# Altium project Netscale48HD_Sensorbar_Slave.PrjPcb
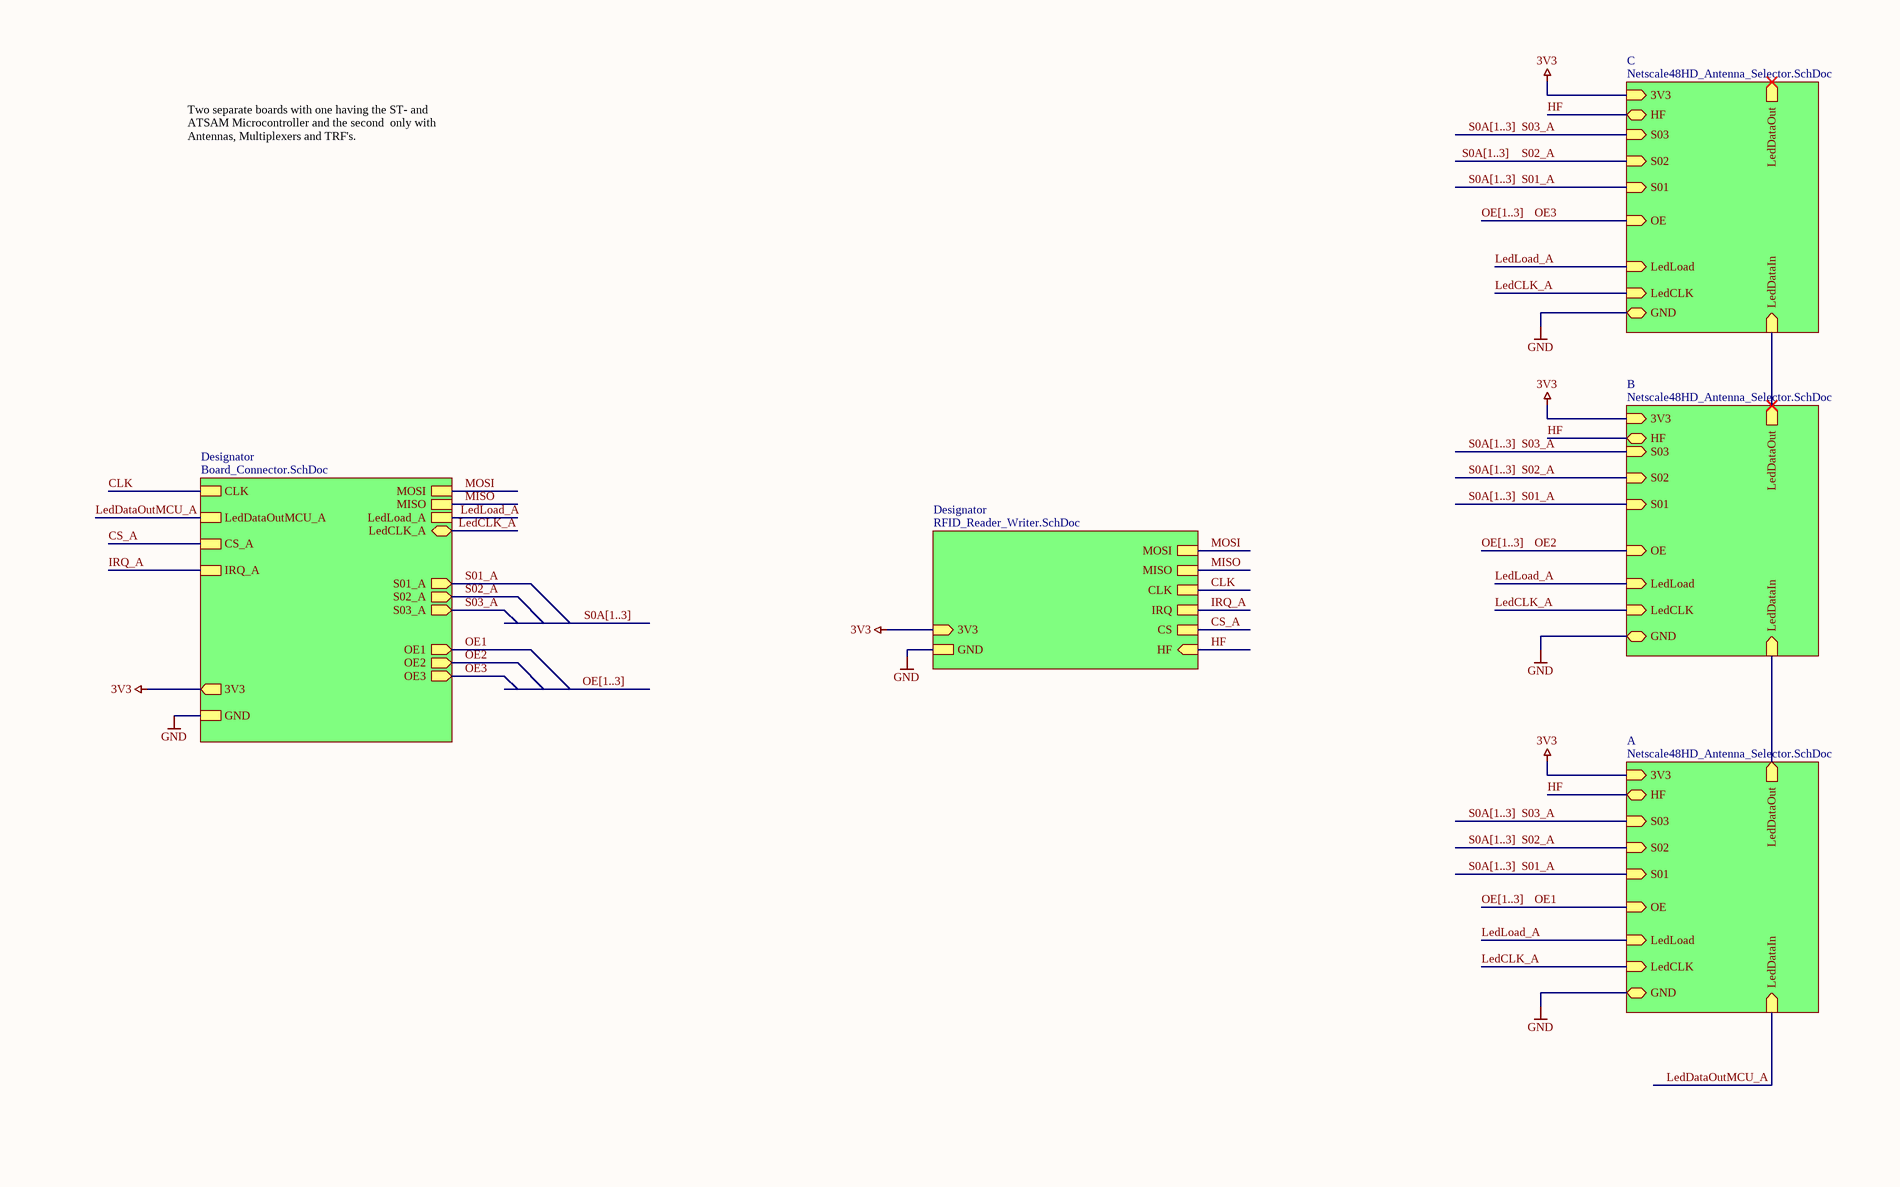
[diagram p0: Netscale48HD_Sensorbar.SchDoc, top]
4 sheets, 214 parts. Net scope: hierarchical (ports join the sheet entries above them; power ports are global).
Board file: Netscale48HD_Sensorbar_Slave.PcbDoc
Sheets:
  Netscale48HD_Sensorbar.SchDoc
    A = Netscale48HD_Antenna_Selector.SchDoc
    B = Netscale48HD_Antenna_Selector.SchDoc
    C = Netscale48HD_Antenna_Selector.SchDoc
    Designator = RFID_Reader_Writer.SchDoc
    Designator = Board_Connector.SchDoc

## Sheet Netscale48HD_Sensorbar.SchDoc: Sensorbar Slave Overall Schematic
size A3; CompanyName: Reichle & De-Massari; Organization: Reichle & De-Massari; Address1: Binzstrasse 32; Address2: 8620 Wetzikon; Address3: Switzerland; DocumentNumber: 1; Revision: V0.2; SheetNumber: 1; SheetTotal: 5

### Sub-sheets
A = Netscale48HD_Antenna_Selector.SchDoc: 3V3 (in), S03 (in), S02 (in), S01 (in), HF (bidir), LedLoad (in), LedCLK (in), GND (bidir), LedDataOut (out), LedDataIn (in), OE (in)
B = Netscale48HD_Antenna_Selector.SchDoc: 3V3 (in), S03 (in), S02 (in), S01 (in), HF (bidir), LedLoad (in), LedCLK (in), GND (bidir), LedDataOut (out), LedDataIn (in), OE (in)
C = Netscale48HD_Antenna_Selector.SchDoc: 3V3 (in), S03 (in), S02 (in), S01 (in), HF (bidir), LedLoad (in), LedCLK (in), GND (bidir), LedDataOut (out), LedDataIn (in), OE (in)
Designator = RFID_Reader_Writer.SchDoc: MOSI, MISO, 3V3 (in), GND, CLK, IRQ, HF (in), CS
Designator = Board_Connector.SchDoc: CLK, 3V3 (out), GND, MOSI, MISO, S01_A (out), S02_A (out), S03_A (out), LedLoad_A, LedCLK_A (bidir), OE1 (out), OE2 (out), OE3 (out), LedDataOutMCU_A, CS_A, IRQ_A

### Nets
3V3: sheet A/3V3, sheet B/3V3, sheet C/3V3, sheet Designator/3V3, sheet Designator/3V3
GND: sheet A/GND, sheet B/GND, sheet C/GND, sheet Designator/GND, sheet Designator/GND
CLK: sheet Designator/CLK, sheet Designator/CLK
CS_A: sheet Designator/CS, sheet Designator/CS_A  [project net CS]
HF: sheet A/HF, sheet B/HF, sheet C/HF, sheet Designator/HF
IRQ_A: sheet Designator/IRQ, sheet Designator/IRQ_A  [project net IRQ]
LedCLK_A: sheet A/LedCLK, sheet B/LedCLK, sheet C/LedCLK, sheet Designator/LedCLK_A  [project net LedCLK]
LedDataIn: sheet A/LedDataOut, sheet B/LedDataIn
LedDataIn: sheet B/LedDataOut, sheet C/LedDataIn  [a separate net that carries the same name]
LedDataOutMCU_A: sheet A/LedDataIn, sheet Designator/LedDataOutMCU_A  [project net LedDataIn]
LedLoad_A: sheet A/LedLoad, sheet B/LedLoad, sheet C/LedLoad, sheet Designator/LedLoad_A  [project net LedLoad]
MISO: sheet Designator/MISO, sheet Designator/MISO
MOSI: sheet Designator/MOSI, sheet Designator/MOSI
OE1: sheet A/OE, sheet Designator/OE1  [project net OE]
OE2: sheet B/OE, sheet Designator/OE2  [project net OE]
OE3: sheet C/OE, sheet Designator/OE3  [project net OE]
S01_A: sheet A/S01, sheet B/S01, sheet C/S01, sheet Designator/S01_A  [project net S01]
S02_A: sheet A/S02, sheet B/S02, sheet C/S02, sheet Designator/S02_A  [project net S02]
S03_A: sheet A/S03, sheet B/S03, sheet C/S03, sheet Designator/S03_A  [project net S03]

### Buses and harness runs
bus OE[1..3]
bus S0A[1..3]

### Notes on the sheet
- 10,8
- 16,8
- 7
- 212,4
- Two separate boards with one having the ST- and ATSAM Microcontroller and the second  only with Antennas, Multiplexers and TRF's.
- Title
- Size:
- Date:
- A3
- Number:
- Time:
- Revision:
- Sheet
- of
- File:

## Sheet Netscale48HD_Antenna_Selector.SchDoc: Antenna Selector & LED
size A3; Author: NK; CompanyName: Reichle & De-Massari; Organization: Reichle & De-Massari; Address1: Binzstrasse 32; Address2: 8620 Wetzikon; Address3: Switzerland; DocumentNumber: 2; Revision: V0.2; SheetNumber: 2; SheetTotal: 2; Organization1: Reichle & De-Massari; Size: A4; ShortDescription: Shift Register for Switches and Leds, multiplexer for Antennas
Used 3 times, as channels A, B, C. Parts and nets are listed once, with the designators drawn on the sheet.
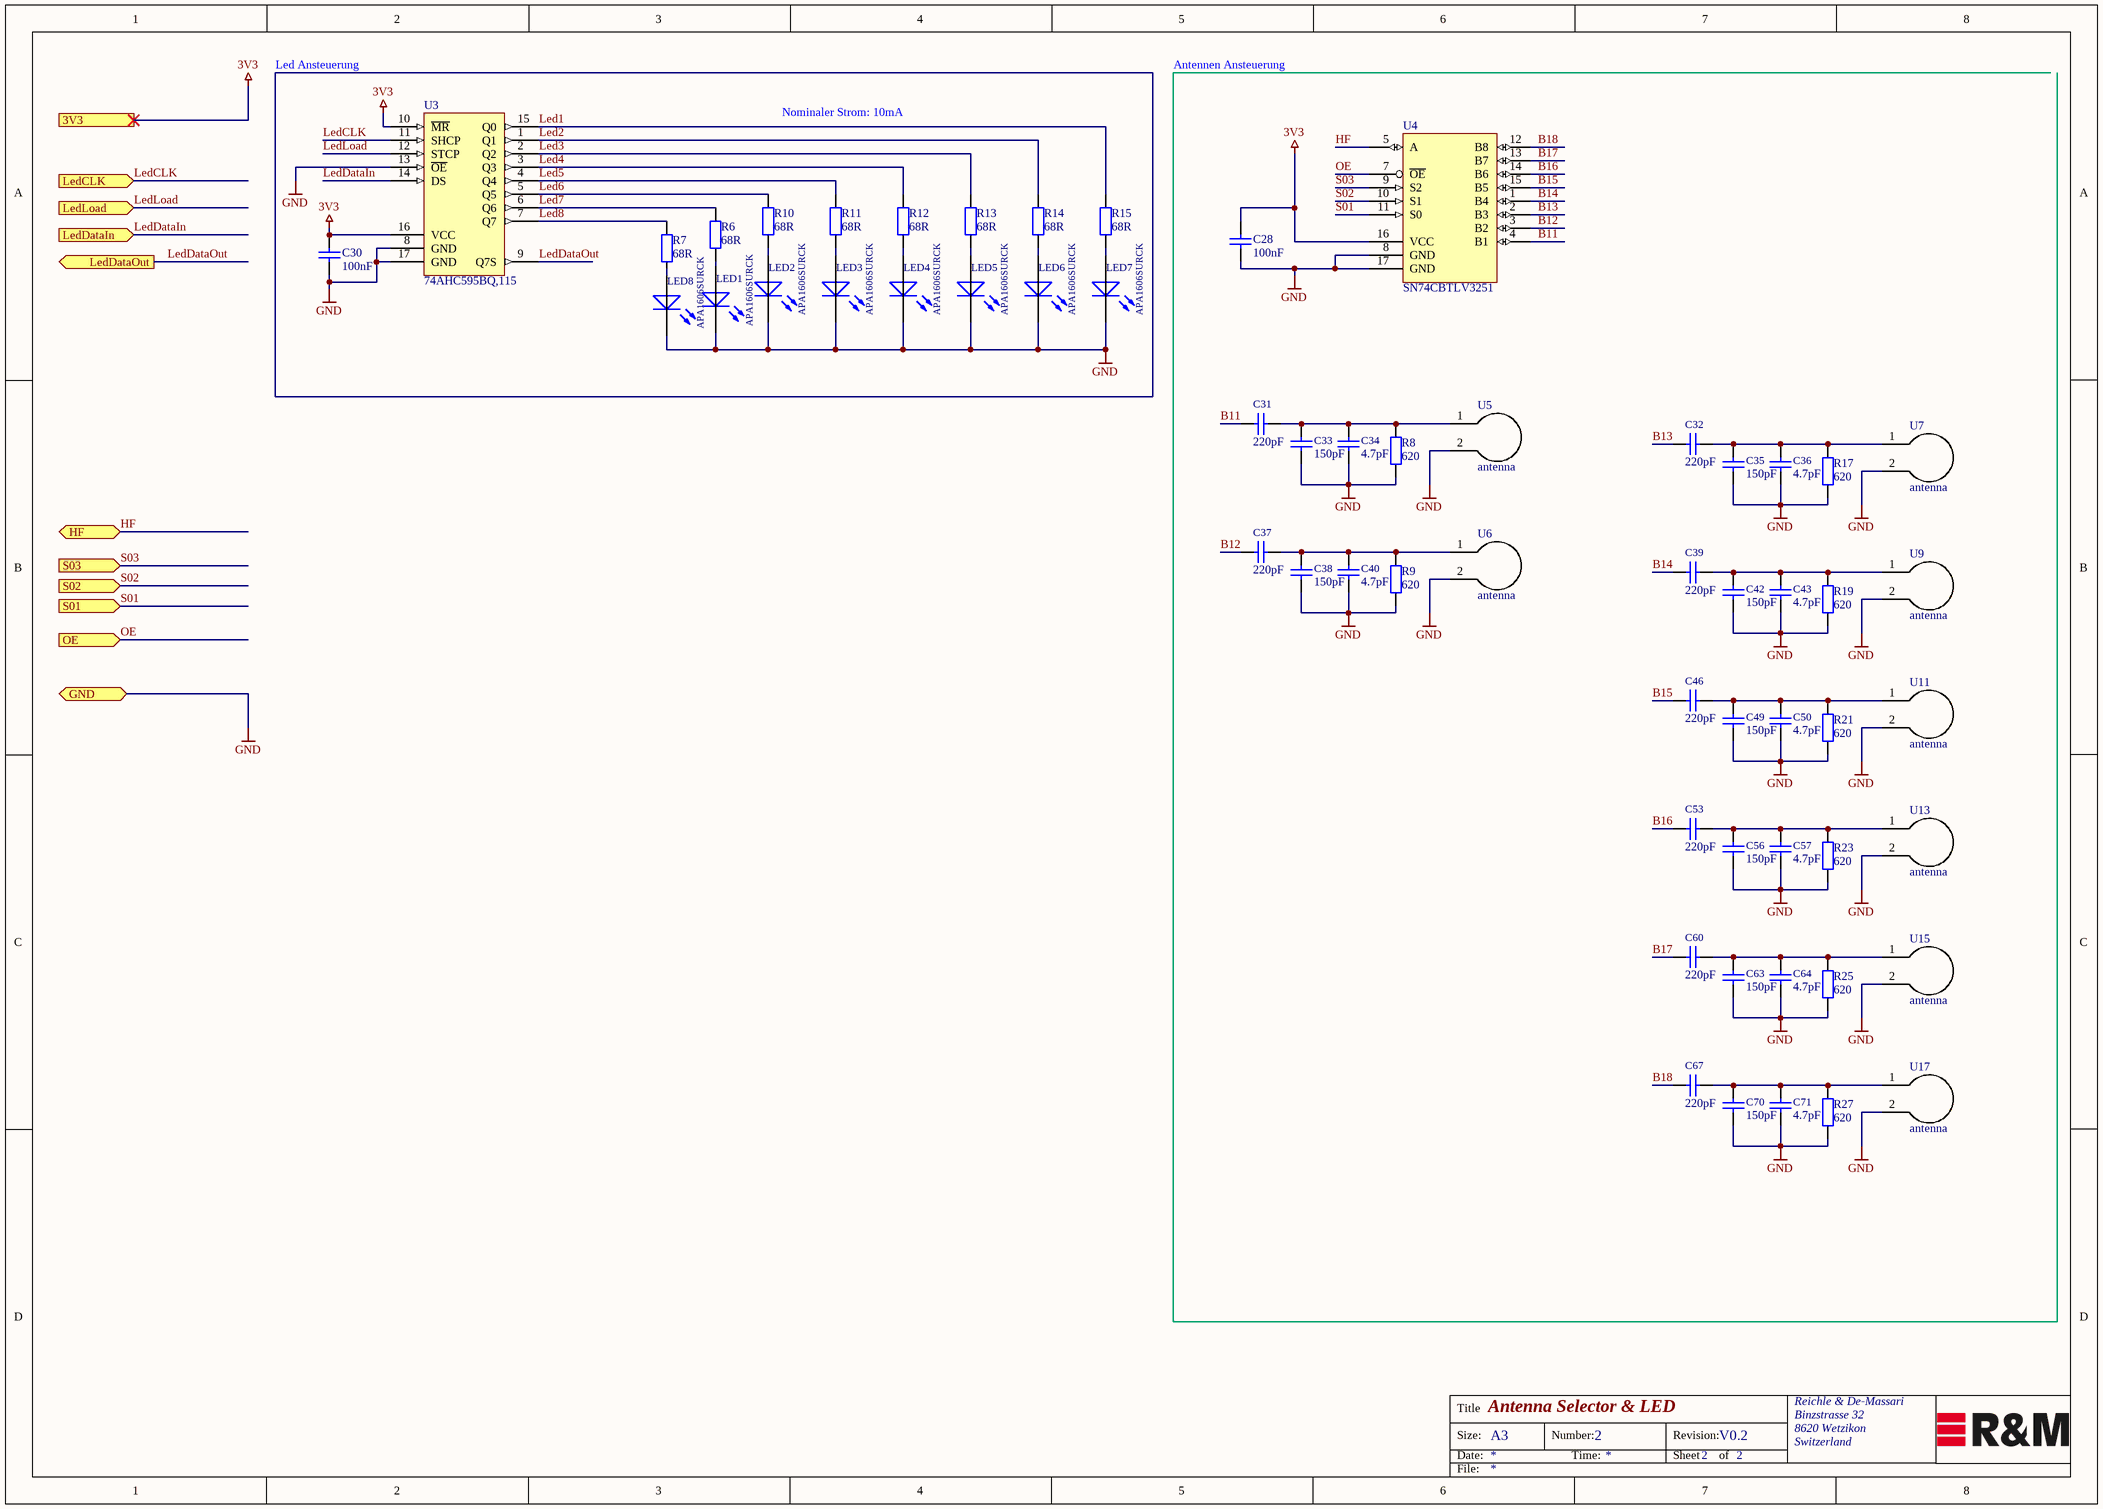
[diagram p1: Netscale48HD_Antenna_Selector.SchDoc]

### Parts
C28  value 100nF  [CAPC1005X55N]  (hidden comment: LMK105BJ104KV-F)
C30  value 100nF  [CAPC1005X55N]  (hidden comment: LMK105BJ104KV-F)
C31  value 220pF  [CAPC1005X55N]  (hidden comment: GCM1555C1H221FA16D)
C32  value 220pF  [CAPC1005X55N]  (hidden comment: GCM1555C1H221FA16D)
C33  value 150pF  [CAPC1005X55N]  (hidden comment: GRM1555C1H151FA01D)
C34  value 4.7pF  [CAPC1005X55N]  (hidden comment: GJM1555C1H4R7WB01D)
C35  value 150pF  [CAPC1005X55N]  (hidden comment: GRM1555C1H151FA01D)
C36  value 4.7pF  [CAPC1005X55N]  (hidden comment: GJM1555C1H4R7WB01D)
C37  value 220pF  [CAPC1005X55N]  (hidden comment: GCM1555C1H221FA16D)
C38  value 150pF  [CAPC1005X55N]  (hidden comment: GRM1555C1H151FA01D)
C39  value 220pF  [CAPC1005X55N]  (hidden comment: GCM1555C1H221FA16D)
C40  value 4.7pF  [CAPC1005X55N]  (hidden comment: GJM1555C1H4R7WB01D)
C42  value 150pF  [CAPC1005X55N]  (hidden comment: GRM1555C1H151FA01D)
C43  value 4.7pF  [CAPC1005X55N]  (hidden comment: GJM1555C1H4R7WB01D)
C46  value 220pF  [CAPC1005X55N]  (hidden comment: GCM1555C1H221FA16D)
C49  value 150pF  [CAPC1005X55N]  (hidden comment: GRM1555C1H151FA01D)
C50  value 4.7pF  [CAPC1005X55N]  (hidden comment: GJM1555C1H4R7WB01D)
C53  value 220pF  [CAPC1005X55N]  (hidden comment: GCM1555C1H221FA16D)
C56  value 150pF  [CAPC1005X55N]  (hidden comment: GRM1555C1H151FA01D)
C57  value 4.7pF  [CAPC1005X55N]  (hidden comment: GJM1555C1H4R7WB01D)
C60  value 220pF  [CAPC1005X55N]  (hidden comment: GCM1555C1H221FA16D)
C63  value 150pF  [CAPC1005X55N]  (hidden comment: GRM1555C1H151FA01D)
C64  value 4.7pF  [CAPC1005X55N]  (hidden comment: GJM1555C1H4R7WB01D)
C67  value 220pF  [CAPC1005X55N]  (hidden comment: GCM1555C1H221FA16D)
C70  value 150pF  [CAPC1005X55N]  (hidden comment: GRM1555C1H151FA01D)
C71  value 4.7pF  [CAPC1005X55N]  (hidden comment: GJM1555C1H4R7WB01D)
LED1  APA1606SURCK  [Kingbright_SMD_2_RWH]
LED2  APA1606SURCK  [Kingbright_SMD_2_RWH]
LED3  APA1606SURCK  [Kingbright_SMD_2_RWH]
LED4  APA1606SURCK  [Kingbright_SMD_2_RWH]
LED5  APA1606SURCK  [Kingbright_SMD_2_RWH]
LED6  APA1606SURCK  [Kingbright_SMD_2_RWH]
LED7  APA1606SURCK  [Kingbright_SMD_2_RWH]
LED8  APA1606SURCK  [Kingbright_SMD_2_RWH]
R6  value 68R  [RESC1005X40N]  (hidden comment: CRGP0402F68R)
R7  value 68R  [RESC1005X40N]  (hidden comment: CRGP0402F68R)
R8  value 620  [RESC1005X40N]  (hidden comment: ERJ-2RKF6200X)
R9  value 620  [RESC1005X40N]  (hidden comment: ERJ-2RKF6200X)
R10  value 68R  [RESC1005X40N]  (hidden comment: CRGP0402F68R)
R11  value 68R  [RESC1005X40N]  (hidden comment: CRGP0402F68R)
R12  value 68R  [RESC1005X40N]  (hidden comment: CRGP0402F68R)
R13  value 68R  [RESC1005X40N]  (hidden comment: CRGP0402F68R)
R14  value 68R  [RESC1005X40N]  (hidden comment: CRGP0402F68R)
R15  value 68R  [RESC1005X40N]  (hidden comment: CRGP0402F68R)
R17  value 620  [RESC1005X40N]  (hidden comment: ERJ-2RKF6200X)
R19  value 620  [RESC1005X40N]  (hidden comment: ERJ-2RKF6200X)
R21  value 620  [RESC1005X40N]  (hidden comment: ERJ-2RKF6200X)
R23  value 620  [RESC1005X40N]  (hidden comment: ERJ-2RKF6200X)
R25  value 620  [RESC1005X40N]  (hidden comment: ERJ-2RKF6200X)
R27  value 620  [RESC1005X40N]  (hidden comment: ERJ-2RKF6200X)
U3  74AHC595BQ,115  [NexperiaUSAInc_16-VFQFN_16_R]
U4  SN74CBTLV3251  [TexasInstruments_16-VFQFN_16_R]
U5  antenna  [antenna_1_layer]  (net tie)
U6  antenna  [antenna_1_layer]  (net tie)
U7  antenna  [antenna_1_layer]  (net tie)
U9  antenna  [antenna_1_layer]  (net tie)
U11  antenna  [antenna_1_layer]  (net tie)
U13  antenna  [antenna_1_layer]  (net tie)
U15  antenna  [antenna_1_layer]  (net tie)
U17  antenna  [antenna_1_layer]  (net tie)

### Ports
3V3, GND (bidir), HF (bidir), LedCLK (in), LedDataIn (in), LedDataOut (out), LedLoad (in), OE (in), S01 (in), S02 (in), S03 (in)

### Nets
3V3: C28.2 C30.2 U3.10(~{MR}) U3.16(VCC) U4.16(VCC) ; port 3V3
GND: C28.1 C30.1 C33.1(Pos) C34.1(Pos) C35.1(Pos) C36.1(Pos) C38.1(Pos) C40.1(Pos) C42.1(Pos) C43.1(Pos) C49.1(Pos) C50.1(Pos) C56.1(Pos) C57.1(Pos) C63.1(Pos) C64.1(Pos) C70.1(Pos) C71.1(Pos) LED1.1(K) LED2.1(K) LED3.1(K) LED4.1(K) LED5.1(K) LED6.1(K) LED7.1(K) LED8.1(K) R8.1 R9.1 R17.1 R19.1 R21.1 R23.1 R25.1 R27.1 U3.8(GND) U3.13(~{OE}) U3.17(GND) U4.8(GND) U4.17(GND) U5.2 U6.2 U7.2 U9.2 U11.2 U13.2 U15.2 U17.2 ; port GND
B11: C31.1(Pos) U4.4(B1)
B12: C37.1(Pos) U4.3(B2)
B13: C32.1(Pos) U4.2(B3)
B14: C39.1(Pos) U4.1(B4)
B15: C46.1(Pos) U4.15(B5)
B16: C53.1(Pos) U4.14(B6)
B17: C60.1(Pos) U4.13(B7)
B18: C67.1(Pos) U4.12(B8)
HF: U4.5(A) ; port HF
Led1: R15.1 U3.15(Q0)
Led2: R14.1 U3.1(Q1)
Led3: R13.1 U3.2(Q2)
Led4: R12.1 U3.3(Q3)
Led5: R11.1 U3.4(Q4)
Led6: R10.1 U3.5(Q5)
Led7: R6.1 U3.6(Q6)
Led8: R7.1 U3.7(Q7)
LedCLK: U3.11(SHCP) ; port LedCLK
LedDataIn: U3.14(DS) ; port LedDataIn
LedDataOut: U3.9(Q7S) ; port LedDataOut
LedLoad: U3.12(STCP) ; port LedLoad
OE: U4.7(~{OE}) ; port OE
S01: U4.11(S0) ; port S01
S02: U4.10(S1) ; port S02
S03: U4.9(S2) ; port S03
NetC31_2: C31.2(Neg) C33.2(Neg) C34.2(Neg) R8.2 U5.1
NetC32_2: C32.2(Neg) C35.2(Neg) C36.2(Neg) R17.2 U7.1
NetC37_2: C37.2(Neg) C38.2(Neg) C40.2(Neg) R9.2 U6.1
NetC39_2: C39.2(Neg) C42.2(Neg) C43.2(Neg) R19.2 U9.1
NetC46_2: C46.2(Neg) C49.2(Neg) C50.2(Neg) R21.2 U11.1
NetC53_2: C53.2(Neg) C56.2(Neg) C57.2(Neg) R23.2 U13.1
NetC60_2: C60.2(Neg) C63.2(Neg) C64.2(Neg) R25.2 U15.1
NetC67_2: C67.2(Neg) C70.2(Neg) C71.2(Neg) R27.2 U17.1
NetLED1_2: LED1.2(A) R6.2
NetLED2_2: LED2.2(A) R10.2
NetLED3_2: LED3.2(A) R11.2
NetLED4_2: LED4.2(A) R12.2
NetLED5_2: LED5.2(A) R13.2
NetLED6_2: LED6.2(A) R14.2
NetLED7_2: LED7.2(A) R15.2
NetLED8_2: LED8.2(A) R7.2

### Channels
A: designators end in _A; ports 3V3=3V3 GND=GND HF=HF LedCLK=LedCLK LedDataIn=LedDataIn LedDataOut=LedDataIn LedLoad=LedLoad OE=OE S01=S01 S02=S02 S03=S03
B: designators end in _B; ports 3V3=3V3 GND=GND HF=HF LedCLK=LedCLK LedDataIn=LedDataIn LedDataOut=LedDataIn LedLoad=LedLoad OE=OE S01=S01 S02=S02 S03=S03
C: designators end in _C; ports 3V3=3V3 GND=GND HF=HF LedCLK=LedCLK LedDataIn=LedDataIn LedDataOut=LedDataOut_C LedLoad=LedLoad OE=OE S01=S01 S02=S02 S03=S03

### Notes on the sheet
- Led Ansteuerung
- Antennen Ansteuerung
- Nominaler Strom: 10mA
- Title
- Size:
- Date:
- A3
- Number:
- Time:
- Revision:
- Sheet
- of
- File:

### Library data of the parts
C28 C30 = CMP-1033-00660-1: 0.1µF ±10% 10V Ceramic Capacitor X5R 0402 (1005 Metric); Manufacturer: Taiyo Yuden; Case-Metric: 0603; Case-EIA: 0201; Rated Voltage: 6.3 V; Tolerance: Â±10%; Max Thickness: 0.33 mm; Technology: SMT; Manufacturer PartNr: LMK105BJ104KV-F
C31 C32 C37 C39 C46 C53 C60 C67 = 706xx_R+M_InteliPhyII_KTI-00070-A.1: 220pF ±1% 50V Ceramic Capacitor C0G, NP0 0402 (1005 Metric); Manufacturer: Murata Electronics; Manufacturer PartNr: GRM033R71E122KA01D
C33 C35 C38 C42 C49 C56 C63 C70 = 706xx_R+M_InteliPhyII_KTI-00069-A.1: 150pF ±1% 50V Ceramic Capacitor C0G, NP0 0402 (1005 Metric); Manufacturer: Murata Electronics North America; Manufacturer PartNr: GRM1555C1H151FA01D
C34 C36 C40 C43 C50 C57 C64 C71 = 706xx_R+M_InteliPhyII_KTI-00023-A.1: 4.7pF ±0.05pF 50V Ceramic Capacitor C0G, NP0 0402 (1005 Metric); Manufacturer: Murata Electronics North America; Manufacturer PartNr: GJM1555C1H4R7WB01D
LED1-LED8 = 706xx_R+M_InteliPhyII_KTI-00048-A.2: Red 630nm LED Indication - Discrete 1.95V 2-SMD, No Lead; Manufacturer: Kingbright; ShortDescription: Description (used in sheet); Manufacturer PartNr: APA1606SURCK
R6 R7 R10-R15 = PassResBas0201-00055-A.2: 68 Ohms ±1% 0.125W, 1/8W Chip Resistor 0402 (1005 Metric) Pulse Withstanding Thick Film; Manufacturer: TE Connectivity Passive Product; #ClassSub: Resistor SMD; #Class: Passiv-Components; Status: nLager; Manufacturer PartNr: CRGP0402F68R
R8 R9 R17 R19 R21 R23 R25 R27 = PassResBas0201-00055-A.2: 620 Ohms ±1% 0.1W, 1/10W Chip Resistor 0402 (1005 Metric) Automotive AEC-Q200 Thick Film; Manufacturer: Panasonic Electronic Components; #ClassSub: Resistor SMD; #Class: Passiv-Components; Status: nLager; Manufacturer PartNr: ERJ-2RKF6200X
U3 = NexperiaUSAInc_74AHC595,115_16-VFQFN_16: IC 8BIT SHIFT REGISTER 16HVQFN; Manufacturer: Nexperia USA Inc.; Manufacturer PartNr: 74AHC595BQ,115
U4 = SN74CBTLV3251RGYR: Multiplexer Switch ICs Sngl-Pole Dbl-Throw Analog Switch; Manufacturer: Texas Instruments; Replaceable: no; Manufacturer PartNr: SN74CBTLV3251RGYR; ComponentLink1Description: mouser; ComponentLink1URL: https://www.mouser.ch/ProductDetail/Texas-Instruments/SN74CBTLV3251RGYR?qs=%2fha2pyFaduj0jkaZeFbDsRaCQjjoxFIhZ%2frFxSESrMpT%252bYmeDnewIw%3d%3d; Footprint/Package: VQFN-16; Supplier 1: Mouser; Supplier 2: Digi-Key; Supplier Part Number 1: 595-SN74CBTLV3251RGY; Supplier Part Number 2: 296-15105-6-ND
U5-U7 U9 U11 U13 U15 U17 = antenna: Replaceable: no; Footprint/Package: *

## Sheet RFID_Reader_Writer.SchDoc: RFID Reader Writer
size A3; Author: NK; CompanyName: Reichle & De-Massari; Organization: Reichle & De-Massari; Address1: Binzstrasse 32; Address2: 8620 Wetzikon; Address3: Switzerland; DocumentNumber: 4; Revision: V0.2; SheetNumber: 1; SheetTotal: 5; Organization1: Reichle & De-Massari; Size: A4; ShortDescription: MCU and RFID Reader
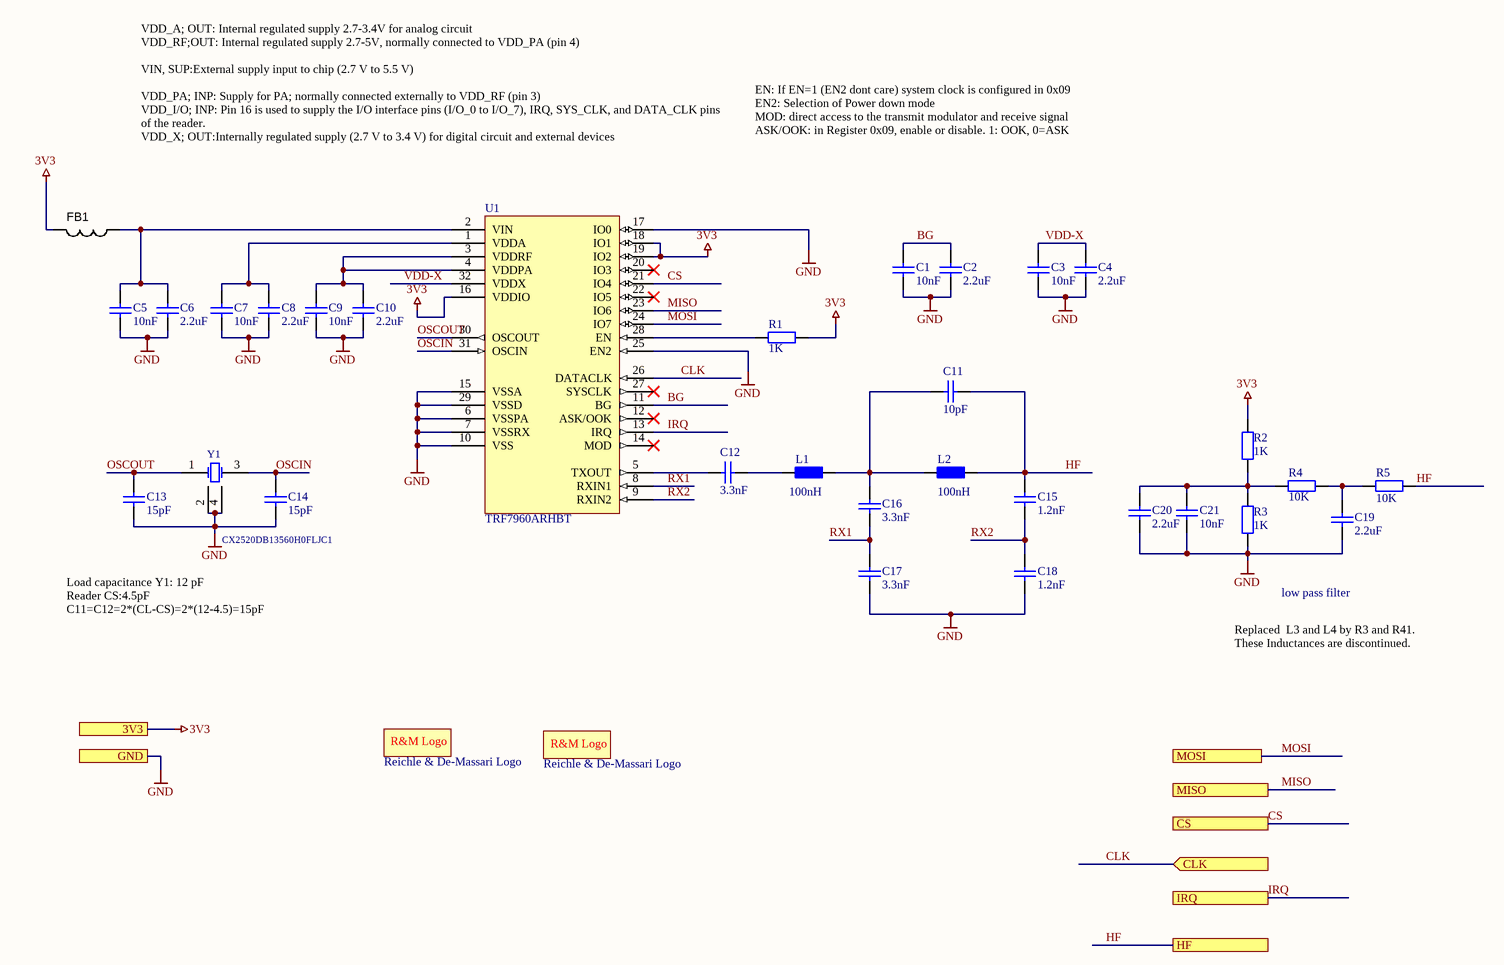
[diagram p2: RFID_Reader_Writer.SchDoc]

### Parts
*1  Reichle & De-Massari Logo  [SYMBOL_R&M]  (no BOM)
*2  Reichle & De-Massari Logo  [SYMBOL_R&M]  (net tie)
C1  10nF  [Ceramic Capacitor 0402 EIA]
C2  2.2uF  [Ceramic Capacitor 0402 EIA]
C3  10nF  [Ceramic Capacitor 0402 EIA]
C4  2.2uF  [Ceramic Capacitor 0402 EIA]
C5  10nF  [Ceramic Capacitor 0402 EIA]
C6  2.2uF  [Ceramic Capacitor 0402 EIA]
C7  10nF  [Ceramic Capacitor 0402 EIA]
C8  2.2uF  [Ceramic Capacitor 0402 EIA]
C9  10nF  [Ceramic Capacitor 0402 EIA]
C10  2.2uF  [Ceramic Capacitor 0402 EIA]
C11  10pF  [Ceramic Capacitor 0402 EIA]
C12  3.3nF  [Ceramic Capacitor 0402 EIA]
C13  15pF  [Ceramic Capacitor 0402 EIA]
C14  15pF  [Ceramic Capacitor 0402 EIA]
C15  1.2nF  [Ceramic Capacitor 0402 EIA]
C16  3.3nF  [Ceramic Capacitor 0402 EIA]
C17  3.3nF  [Ceramic Capacitor 0402 EIA]
C18  1.2nF  [Ceramic Capacitor 0402 EIA]
C19  2.2uF  [Ceramic Capacitor 0402 EIA]
C20  2.2uF  [Ceramic Capacitor 0402 EIA]
C21  10nF  [Ceramic Capacitor 0402 EIA]
FB1  BK1005HS102-T  [CAPC1005X55N]  (value not drawn)
L1  value 100nH  [Inductor 0603 EIA]  (hidden comment: HK1608R10J-T)
L2  value 100nH  [Inductor 0603 EIA]  (hidden comment: HK1608R10J-T)
R1  1K  [Resistor 0402 EIA]
R2  1K  [Resistor 0402 EIA]
R3  1K  [Resistor 0402 EIA]
R4  10K  [Resistor 0402 EIA]
R5  10K  [Resistor 0402 EIA]
U1  TRF7960ARHBT  [TexasInstruments_32-VFQFN_32_R]
Y1  CX2520DB13560H0FLJC1  [AVX/Kyocera_DFN4_4_RWH]

### Ports
3V3, CLK (in), CS, GND, HF, IRQ, MISO, MOSI

### Nets
3V3: FB1.2 R1.2 R2.1 U1.16(VDDIO) U1.18(IO1) U1.19(IO2) ; port 3V3
GND: C1.1 C2.1 C3.1 C4.1 C5.1 C6.1 C7.1 C8.1 C9.1 C10.1 C13.1 C14.1 C17.1 C18.1 C19.1 C20.1 C21.1 R3.2 U1.6(VSSPA) U1.7(VSSRX) U1.10(VSS) U1.15(VSSA) U1.17(IO0) U1.25(EN2) U1.29(VSSD) Y1.2(OSC2) Y1.4(OSC3) ; port GND
BG: C1.2 C2.2 U1.11(BG)
CLK: U1.26(DATACLK) ; port CLK
CS: U1.21(IO4) ; port CS
HF: C11.1 C15.2 L2.2 R5.2 ; port HF
IRQ: U1.13(IRQ) ; port IRQ
MISO: U1.23(IO6) ; port MISO
MOSI: U1.24(IO7) ; port MOSI
OSCIN: C14.2 U1.31(OSCIN) Y1.3(OSC2)
OSCOUT: C13.2 U1.30(OSCOUT) Y1.1(OSC1)
RX1: C16.1 C17.2 U1.8(RXIN1)
RX2: C15.1 C18.2 U1.9(RXIN2)
VDD-X: C3.2 C4.2 U1.32(VDDX)
NetC5_2: C5.2 C6.2 FB1.1 U1.2(VIN)
NetC7_2: C7.2 C8.2 U1.1(VDDA)
NetC9_2: C9.2 C10.2 U1.3(VDDRF) U1.4(VDDPA)
NetC11_2: C11.2 C16.2 L1.2 L2.1
NetC12_1: C12.1 L1.1
NetC12_2: C12.2 U1.5(TXOUT)
NetC19_2: C19.2 R4.2 R5.1
NetC20_2: C20.2 C21.2 R2.2 R3.1 R4.1
NetR1_1: R1.1 U1.28(EN)

Not connected (* = marked no-connect by the designer): U1 12(ASK/OOK)* 14(MOD)* 20(IO3)* 22(IO5)* 27(SYSCLK)*

### Notes on the sheet
- VDD_A; OUT: Internal regulated supply 2.7-3.4V for analog circuit
  VDD_RF;OUT: Internal regulated supply 2.7-5V, normally connected to VDD_PA (pin 4)
  VIN, SUP:External supply input to chip (2.7 V to 5.5 V)
  VDD_PA; INP: Supply for PA; normally connected externally to VDD_RF (pin 3)
  VDD_I/O; INP: Pin 16 is used to supply the I/O interface pins (I/O_0 to I/O_7), IRQ, SYS_CLK, and DATA_CLK pins of the reader.
  VDD_X; OUT:Internally regulated supply (2.7 V to 3.4 V) for digital circuit and external devices
- EN: If EN=1 (EN2 dont care) system clock is configured in 0x09
  EN2: Selection of Power down mode
  MOD: direct access to the transmit modulator and receive signal
  ASK/OOK: in Register 0x09, enable or disable. 1: OOK, 0=ASK
- Load capacitance Y1: 12 pF
  Reader CS:4.5pF
  C11=C12=2*(CL-CS)=2*(12-4.5)=15pF
- Replaced  L3 and L4 by R3 and R41. These Inductances are discontinued.
- low pass filter
- Title
- Size:
- Date:
- A3
- Number:
- Time:
- Revision:
- Sheet
- of
- File:
- (in symbol SYMBOL_R&M) R&M Logo

### Library data of the parts
*1 = SYMBOL_R&M: Replaceable: no; Footprint/Package: 2.54mm
*2 = SYMBOL_R&M: Replaceable: no; value: Overlay; Footprint/Package: 2.54mm
C1 C3 C5 C7 C9 C21 = Cap_10nF_0402: 10000pF ±10% 50V Keramikkondensatoren X7R 0402 (1005 metrisch) CL05B103KB5NNNC; Manufacturer: Samsung Electro-Mechanics; voltage: 50 VDC; Replaceable: yes; value: 10nF; tolerance: ±10%; ComponentLink1Description: mouser; ComponentLink1URL: https://www.mouser.ch/ProductDetail/Murata-Electronics/ZRB15XR61A106ME01D?qs=sGAEpiMZZMs0AnBnWHyRQN7%2fAA2D2lPPC0%2fdyv23S%2fU%252bBeuYI5b1UA%3d%3d; Manufacturer PartNr: CL05B103KB5NNNC; Footprint/Package: 0402; Dielectric Grade: X7R; Supplier 1: Digi-Key; Supplier Part Number 1: 1276-1028-1-ND
C2 C4 C6 C8 C10 = Cap_2.2uF_0402: Multilayer Ceramic Capacitors MLCC - SMD/SMT 0402 2.2uF 6.3volts *Derate Voltage/Temp, 2.2µF ±20% 25V Ceramic Capacitor X5R 0402 (1005 Metric); Manufacturer: Murata; Manufacturer PartNr: GRM155R60J225ME15D; voltage: 6,3V; Replaceable: yes; value: 2.2uF; tolerance: ±20%; Dielectric Grade: X5R; Footprint/Package: 0402; ComponentLink1Description: digikey; ComponentLink1URL: https://www.digikey.com/product-detail/en/murata-electronics-north-america/GRM155R61E225ME15D/490-10457-2-ND/5027542; Supplier 1: Digi-Key; Supplier Part Number 1: 490-4519-1-ND
C11 = Cap_10pF_0402: Multilayer Ceramic Capacitors MLCC - SMD/SMT 0402 10pF 50Volts C0G 1%; Manufacturer: Murata; Manufacturer PartNr: GJM1555C1H100FB01D; voltage: 50 VDC; Replaceable: yes; value: 10pF; tolerance: ±1%; Dielectric Grade: C0G; Footprint/Package: 0402; ComponentLink1Description: digikey; ComponentLink1URL: https://www.digikey.com/product-detail/en/murata-electronics-north-america/GRM155R61E225ME15D/490-10457-2-ND/5027542; Supplier 1: Mouser; Supplier Part Number 1: 81-GJM1555C1H100FB01
C12 C16 C17 = Cap_3.3nF_0402: Multilayer Ceramic Capacitors MLCC - SMD/SMT 0402 3300pF 50volts X7R 5%; Manufacturer: Murata; Manufacturer PartNr: GCM155R71H332JA37D; voltage: 50 VDC; Replaceable: yes; value: 3.3nF; tolerance: ±5%; Dielectric Grade: X7R; Footprint/Package: 0402; ComponentLink1Description: digikey; ComponentLink1URL: https://www.digikey.com/product-detail/en/murata-electronics-north-america/GRM155R61E225ME15D/490-10457-2-ND/5027542; Supplier 1: Digi-Key; Supplier Part Number 1: 490-16426-1-ND
C13 C14 = Cap_15pF_0402: Multilayer Ceramic Capacitors MLCC - SMD/SMT 0402 15pF 50Volts C0G 5%, Multilayer Ceramic Capacitors MLCC; Manufacturer: Murata; Manufacturer PartNr: GJM1555C1H150FB01D; tolerance: ±1%; voltage: 50 VDC; Replaceable: yes; value: 15pF; ComponentLink1Description: mouser; ComponentLink1URL: https://www.mouser.ch/ProductDetail/Murata-Electronics/ZRB15XR61A106ME01D?qs=sGAEpiMZZMs0AnBnWHyRQN7%2fAA2D2lPPC0%2fdyv23S%2fU%252bBeuYI5b1UA%3d%3d; Footprint/Package: 0402; Dielectric Grade: C0G; Supplier 1: Digi-Key; Supplier Part Number 1: 490-11191-1-ND
C15 C18 = Cap_1.2nF_0402: Multilayer Ceramic Capacitors MLCC - SMD/SMT 50V 1200pF C0G 0402 5%; Manufacturer: Kemet; Manufacturer PartNr: C0402C122J5GACTU; voltage: 50 VDC; Replaceable: yes; value: 1.2nF; tolerance: ±5%; ComponentLink1Description: mouser; ComponentLink1URL: https://www.mouser.ch/ProductDetail/Murata-Electronics/ZRB15XR61A106ME01D?qs=sGAEpiMZZMs0AnBnWHyRQN7%2fAA2D2lPPC0%2fdyv23S%2fU%252bBeuYI5b1UA%3d%3d; Footprint/Package: 0402; Dielectric Grade: C0G; Supplier 1: Digi-Key; Supplier Part Number 1: 399-7334-1-ND
C19 C20 = Cap_2.2uF_0402_6.3V: Multilayer Ceramic Capacitors MLCC - SMD/SMT 0402 2.2uF 6.3volts; Manufacturer: Murata; Manufacturer PartNr: GRM155R60J225ME15D; tolerance: 20%; voltage: 6.3V; Replaceable: yes; Dielectric Grade: X5R; value: 2.2uF; Footprint/Package: 0402 (1005 metric); Supplier 1: Mouser; Supplier Part Number 1: 81-GRM155R60J225ME5D
FB1 = FERRITE_2K2-100MHz_0603: FERRITE BEAD 1 KOHM 0402 1LN; Manufacturer: Taiyo Yuden; Manufacturer PartNr: BK1005HS102-T
L1 L2 = 706xx_R+M_InteliPhyII_KTI-00029-A.1: 100nH Unshielded Multilayer Inductor 300mA 100 mOhm Max 0603 (1608 Metric); Manufacturer: Taiyo Yuden; Manufacturer PartNr: HK1608R10J-T
R1-R3 = Res_1K_0402: RES SMD 1K OHM 1% 1/16W 0402; Manufacturer: Yageo; Manufacturer PartNr: RC0402FR-071KL; power: 0,063W, 1/16W; Replaceable: yes; value: 1K; tolerance: ±1%; Footprint/Package: 0402 (1005 metric); Supplier 1: Digi-Key; Supplier Part Number 1: 311-1.00KLRCT-ND
R4 R5 = Res_10K_0402: SMD 10K ohm 1% 50V General Purpose; Manufacturer: Yageo; Manufacturer PartNr: RC0402FR-1010KL; power: 63mW; Replaceable: yes; value: 10K; tolerance: 1%; ComponentLink1Description: mouser; ComponentLink1URL: https://www.mouser.ch/ProductDetail/Yageo/RC0402FR-1010KL?qs=sGAEpiMZZMtlubZbdhIBIEgN9MQql2m6Sb2LnYlCICU%3d; Footprint/Package: 0402; Supplier 1: Mouser; Supplier Part Number 1: 603-RC0402FR-1010KL
U1 = TexasInstruments_TRF7960ARHBT_32-VFQFN_32: Manufacturer: Texas Instruments; Manufacturer PartNr: TRF7960ARHBT
Y1 = CRYSTAL_4Pin_1_3_1: 13.56MHz ±10ppm Crystal 12pF 150 Ohms 4-SMD, No Lead; Manufacturer: Kyocera International Inc. Electronic Components; Manufacturer PartNr: CX2520DB13560H0FLJC1

## Sheet Board_Connector.SchDoc: Board_Connector
size A3; CompanyName: Reichle & De-Massari; Organization: Reichle & De-Massari; Address1: Binzstrasse 32; Address2: 8620 Wetzikon; Address3: Switzerland; DocumentNumber: 5; Revision: V0.2; SheetNumber: 5; SheetTotal: 5
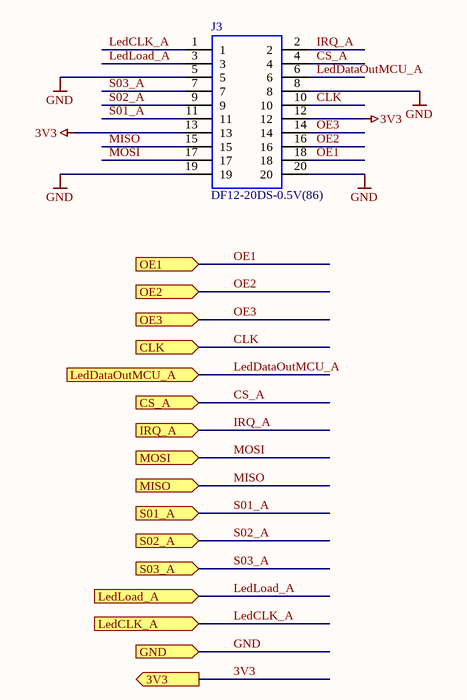
[diagram p3: Board_Connector.SchDoc]

### Parts
J3  DF12-20DS-0.5V(86)  [DF12-20DS]

### Ports
3V3 (out), CLK (in), CS_A (in), GND (in), IRQ_A (in), LedCLK_A (in), LedDataOutMCU_A (in), LedLoad_A (in), MISO (in), MOSI (in), OE1 (in), OE2 (in), OE3 (in), S01_A (in), S02_A (in), S03_A (in)

### Nets
3V3: J3.12 J3.13 ; port 3V3
GND: J3.5 J3.8 J3.19 J3.20 ; port GND
CLK: J3.10 ; port CLK
CS_A: J3.4 ; port CS_A  [project net CS]
IRQ_A: J3.2 ; port IRQ_A  [project net IRQ]
LedCLK_A: J3.1 ; port LedCLK_A  [project net LedCLK]
LedDataOutMCU_A: J3.6 ; port LedDataOutMCU_A  [project net LedDataIn]
LedLoad_A: J3.3 ; port LedLoad_A  [project net LedLoad]
MISO: J3.15 ; port MISO
MOSI: J3.17 ; port MOSI
OE1: J3.18 ; port OE1  [project net OE]
OE2: J3.16 ; port OE2  [project net OE]
OE3: J3.14 ; port OE3  [project net OE]
S01_A: J3.11 ; port S01_A  [project net S01]
S02_A: J3.9 ; port S02_A  [project net S02]
S03_A: J3.7 ; port S03_A  [project net S03]

### Notes on the sheet
- Title
- Size:
- Date:
- A3
- Number:
- Time:
- Revision:
- Sheet
- of
- File:

### Library data of the parts
J3 = DF12-20DS-0.5V(86): Connector,Board to Board,DF12 Hirose DF12 Series 0.5mm 20 Way 2 Row Straight PCB Socket Surface Mount Board to Board; Allied_Number: R1051087; Manufacturer: Hirose; Manufacturer PartNr: DF12-20DS-0.5V(86); RS Part Number: 1722478; RS Price/Stock: http://uk.rs-online.com/web/p/products/1722478; Allied Price/Stock: http://www.alliedelec.com/hirose-electric-df12-20ds-0-5v-86-/R1051087/; Mouser Part Number: 798-DF12-20DS-0.5V86; Mouser Price/Stock: https://www.mouser.com/Search/Refine.aspx?Keyword=798-DF12-20DS-0.5V86; Datasheet Link: https://www.hirose.com/product/en/products/DF12

## Nets that join several sheets
3V3: A (5 pins), B (5 pins), C (5 pins), RFID_Reader_Writer (6 pins), Board_Connector (J3.12 J3.13)
GND: A (47 pins), B (47 pins), C (47 pins), RFID_Reader_Writer (27 pins), Board_Connector (J3.5 J3.8 J3.19 J3.20)
CLK: RFID_Reader_Writer (U1.26), Board_Connector (J3.10)
CS: RFID_Reader_Writer (U1.21), Board_Connector (J3.4)
HF: A (U4_A.5), B (U4_B.5), C (U4_C.5), RFID_Reader_Writer (C11.1 C15.2 L2.2 R5.2)
IRQ: RFID_Reader_Writer (U1.13), Board_Connector (J3.2)
LedCLK: A (U3_A.11), B (U3_B.11), C (U3_C.11), Board_Connector (J3.1)
LedDataIn: A (U3_A.9), B (U3_B.14)
LedDataIn: A (U3_A.14), Board_Connector (J3.6)
LedDataIn: B (U3_B.9), C (U3_C.14)
LedLoad: A (U3_A.12), B (U3_B.12), C (U3_C.12), Board_Connector (J3.3)
MISO: RFID_Reader_Writer (U1.23), Board_Connector (J3.15)
MOSI: RFID_Reader_Writer (U1.24), Board_Connector (J3.17)
OE: A (U4_A.7), Board_Connector (J3.18)
OE: B (U4_B.7), Board_Connector (J3.16)
OE: C (U4_C.7), Board_Connector (J3.14)
S01: A (U4_A.11), B (U4_B.11), C (U4_C.11), Board_Connector (J3.11)
S02: A (U4_A.10), B (U4_B.10), C (U4_C.10), Board_Connector (J3.9)
S03: A (U4_A.9), B (U4_B.9), C (U4_C.9), Board_Connector (J3.7)